# EAGLE design video_kb (EAGLE 7.1.0)
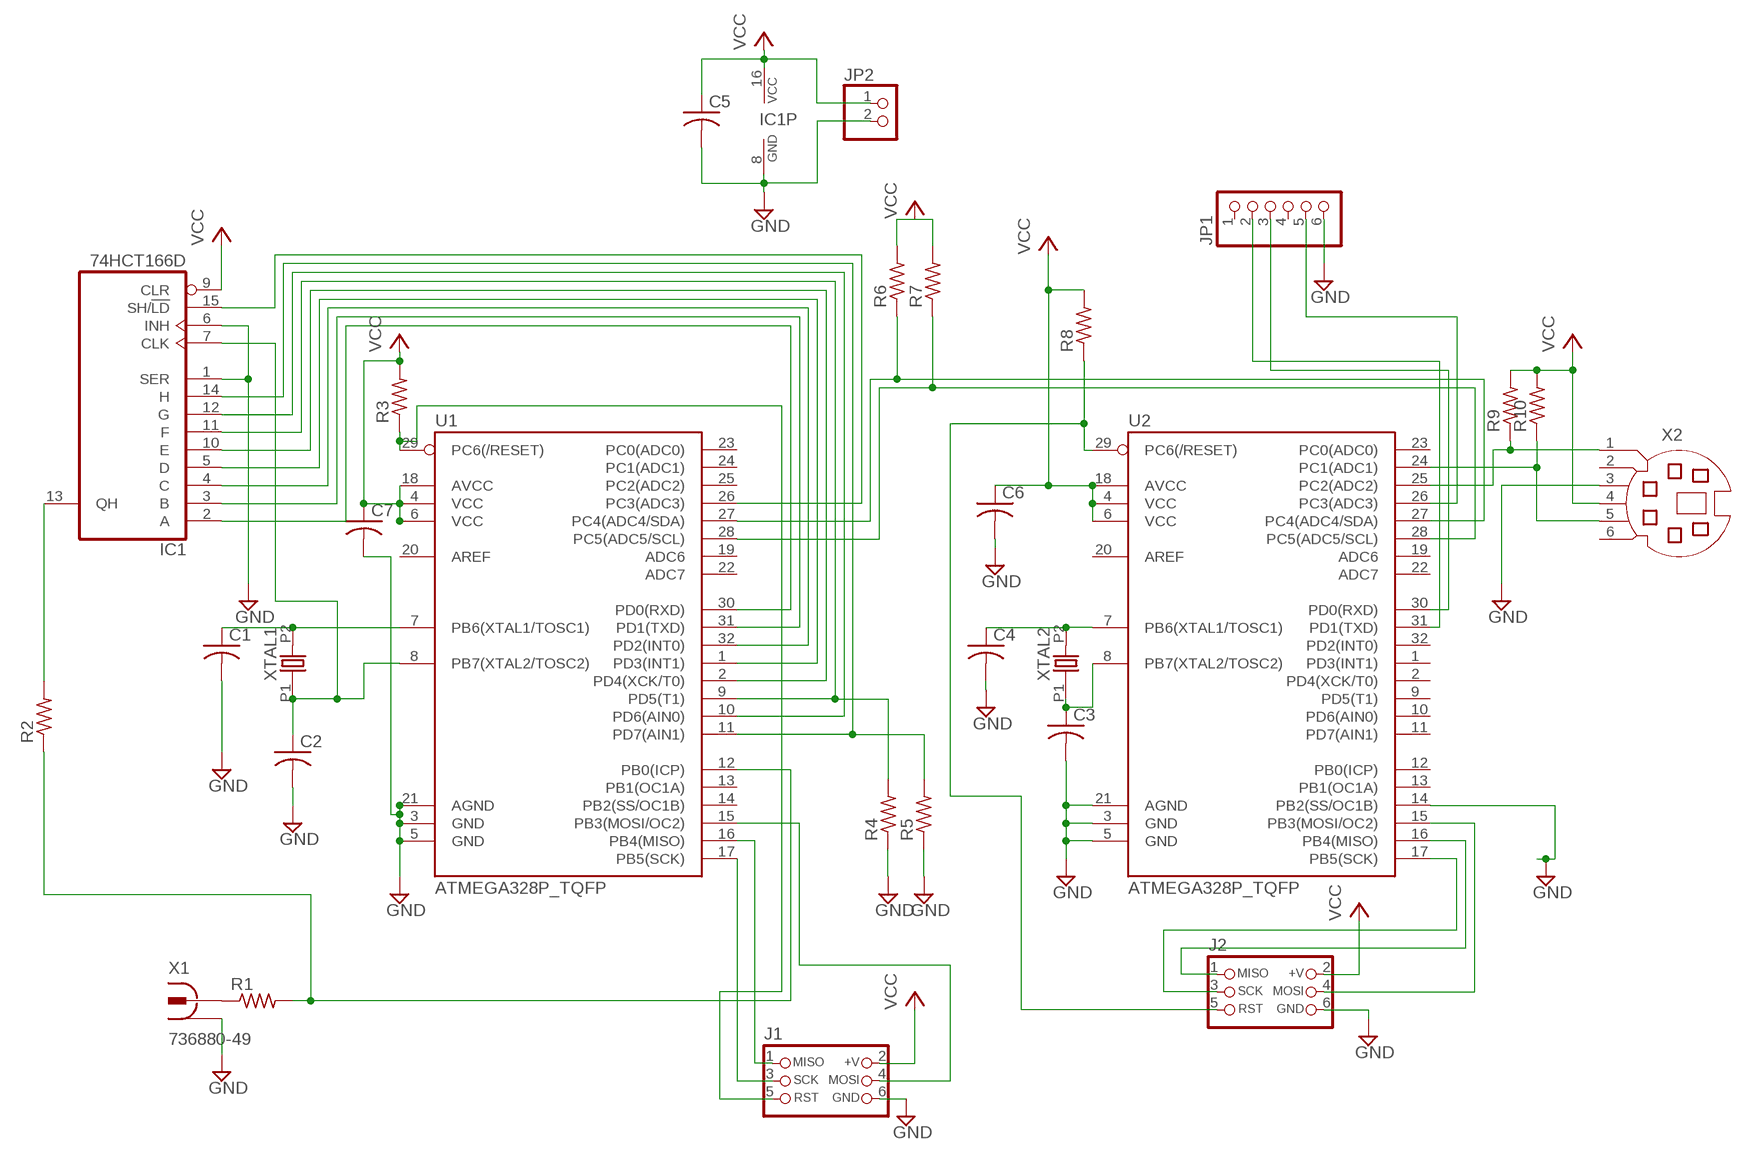
[diagram p0: schematic, sheet 1]

## Parts
C1  C-USC0603K  [C0603K]
C2  C-USC0603K  [C0603K]
C3  C-USC0603K  [C0603K]
C4  C-USC0603K  [C0603K]
C5  C-USC0603K  [C0603K]
C6  C-USC0603K  [C0603K]
C7  C-USC0603K  [C0603K]
IC1  74HCT166D  [SO16]
J1  CON_HEADER_PRG_AVR_ICSP-PTH  [HEADER_PRG_2X03]
J2  CON_HEADER_PRG_AVR_ICSP-PTH  [HEADER_PRG_2X03]
JP1  HEADER-1X6  [1X06_OVAL]
JP2  HEADER-1X2  [1X02_OVAL]
R1  R-US_R0603  [R0603]
R2  R-US_R0603  [R0603]
R3  R-US_R0603  [R0603]
R4  R-US_R0603  [R0603]
R5  R-US_R0603  [R0603]
R6  R-US_R0603  [R0603]
R7  R-US_R0603  [R0603]
R8  R-US_R0603  [R0603]
R9  R-US_R0603  [R0603]
R10  R-US_R0603  [R0603]
U1  ATMEGA328P_TQFP  [TQFP32-08]
U2  ATMEGA328P_TQFP  [TQFP32-08]
X1  736880-49  [736880-49]
X2  MD06S  [MDIN06S]
XTAL1  OSC-XTAL-HC-49U-PTH  [HC-49U-PTH]
XTAL2  OSC-XTAL-HC-49U-PTH  [HC-49U-PTH]

## Nets
GND: C1.2 C2.2 C3.2 C4.2 C5.2 C6.2 C7.2 IC1.1(SER) IC1.6(INH) IC1.8(GND) J1.6(GND) J2.6(GND) JP1.6 JP2.2 R4.1 R5.1 U1.3(GND) U1.5(GND) U1.21(AGND) U2.3(GND) U2.5(GND) U2.14(PB2(SS/OC1B)) U2.21(AGND) X1.1 X1.1@1 X1.1@2 X2.3
N$1: C2.1 IC1.7(CLK) U1.8(PB7(XTAL2/TOSC2)) XTAL1.P1
N$2: C1.1 U1.7(PB6(XTAL1/TOSC1)) XTAL1.P2
N$3: IC1.4(C) U1.32(PD2(INT0))
N$4: IC1.5(D) U1.1(PD3(INT1))
N$5: R1.2 R2.1 U1.12(PB0(ICP))
N$6: R1.1 X1.2
N$7: IC1.13(QH) R2.2
N$8: IC1.10(E) U1.2(PD4(XCK/T0))
N$9: IC1.2(A) U1.30(PD0(RXD))
N$10: IC1.3(B) U1.31(PD1(TXD))
N$11: IC1.11(F) R4.2 U1.9(PD5(T1))
N$12: IC1.12(G) U1.10(PD6(AIN0))
N$13: IC1.14(H) R5.2 U1.11(PD7(AIN1))
N$14: J1.5(RST) R3.1 U1.29(PC6(/RESET))
N$15: IC1.15(SH/!LD) U1.26(PC3(ADC3))
N$16: R6.1 U1.27(PC4(ADC4/SDA)) U2.27(PC4(ADC4/SDA))
N$18: R7.1 U1.28(PC5(ADC5/SCL)) U2.28(PC5(ADC5/SCL))
N$19: J1.4(MOSI) U1.15(PB3(MOSI/OC2))
N$20: C4.1 U2.7(PB6(XTAL1/TOSC1)) XTAL2.P2
N$21: C3.1 U2.8(PB7(XTAL2/TOSC2)) XTAL2.P1
N$22: J2.5(RST) R8.1 U2.29(PC6(/RESET))
N$24: J2.4(MOSI) U2.15(PB3(MOSI/OC2))
N$26: R9.1 U2.25(PC2(ADC2)) X2.1
N$27: J2.1(MISO) U2.16(PB4(MISO))
N$28: J2.3(SCK) U2.17(PB5(SCK))
N$29: R10.1 U2.24(PC1(ADC1)) X2.5
N$34: JP1.5 U2.26(PC3(ADC3))
N$35: JP1.3 U2.30(PD0(RXD))
N$36: JP1.2 U2.31(PD1(TXD))
N$37: J1.1(MISO) U1.16(PB4(MISO))
N$38: J1.3(SCK) U1.17(PB5(SCK))
VCC: C5.1 C6.1 C7.1 IC1.9(CLR) IC1.16(VCC) J1.2(+V) J2.2(+V) JP2.1 R3.2 R6.2 R7.2 R8.2 R9.2 R10.2 U1.4(VCC) U1.6(VCC) U1.18(AVCC) U2.4(VCC) U2.6(VCC) U2.18(AVCC) X2.4
Unconnected: JP1.1 JP1.4 U1.13(PB1(OC1A)) U1.14(PB2(SS/OC1B)) U1.19(ADC6) U1.20(AREF) U1.22(ADC7) U1.23(PC0(ADC0)) U1.24(PC1(ADC1)) U1.25(PC2(ADC2)) U2.1(PD3(INT1)) U2.2(PD4(XCK/T0)) U2.9(PD5(T1)) U2.10(PD6(AIN0)) U2.11(PD7(AIN1)) U2.12(PB0(ICP)) U2.13(PB1(OC1A)) U2.19(ADC6) U2.20(AREF) U2.22(ADC7) U2.23(PC0(ADC0)) U2.32(PD2(INT0)) X2.2 X2.6

## Library data of the parts
C1-C7 = rcl:C-US: CAPACITOR, American symbol
IC1 = 74xx-eu:74*166: 8-bit parallel load SHIFT REGISTER
J1 J2 = dp_devices:CON_HEADER_PRG_AVR_ICSP: 2x3 AVR ICSP programming header
JP1 = microbuilder:HEADER-1X6: PIN HEADER
JP2 = microbuilder:HEADER-1X2: PIN HEADER
R1-R10 = resistor:R-US_: RESISTOR, American symbol
U1 U2 = SparkFun-DigitalIC:ATMEGA328P_TQFP; PROD_ID: IC-09069
X1 = con-conrad:736880-49: Cinch Connector ( RCA Jack ) Cinch-Einbaukupplung 90º 72345 Vernickelt BKL Electronic Source: Conrad <http://www.conrad.de/ce/de/product/736880>
X2 = con-yamaichi:MD06S: YAMAICHI CONNECTOR; OC_FARNELL: unknown; OC_NEWARK: unknown
XTAL1 XTAL2 = dp_devices:OSC-XTAL

## Board
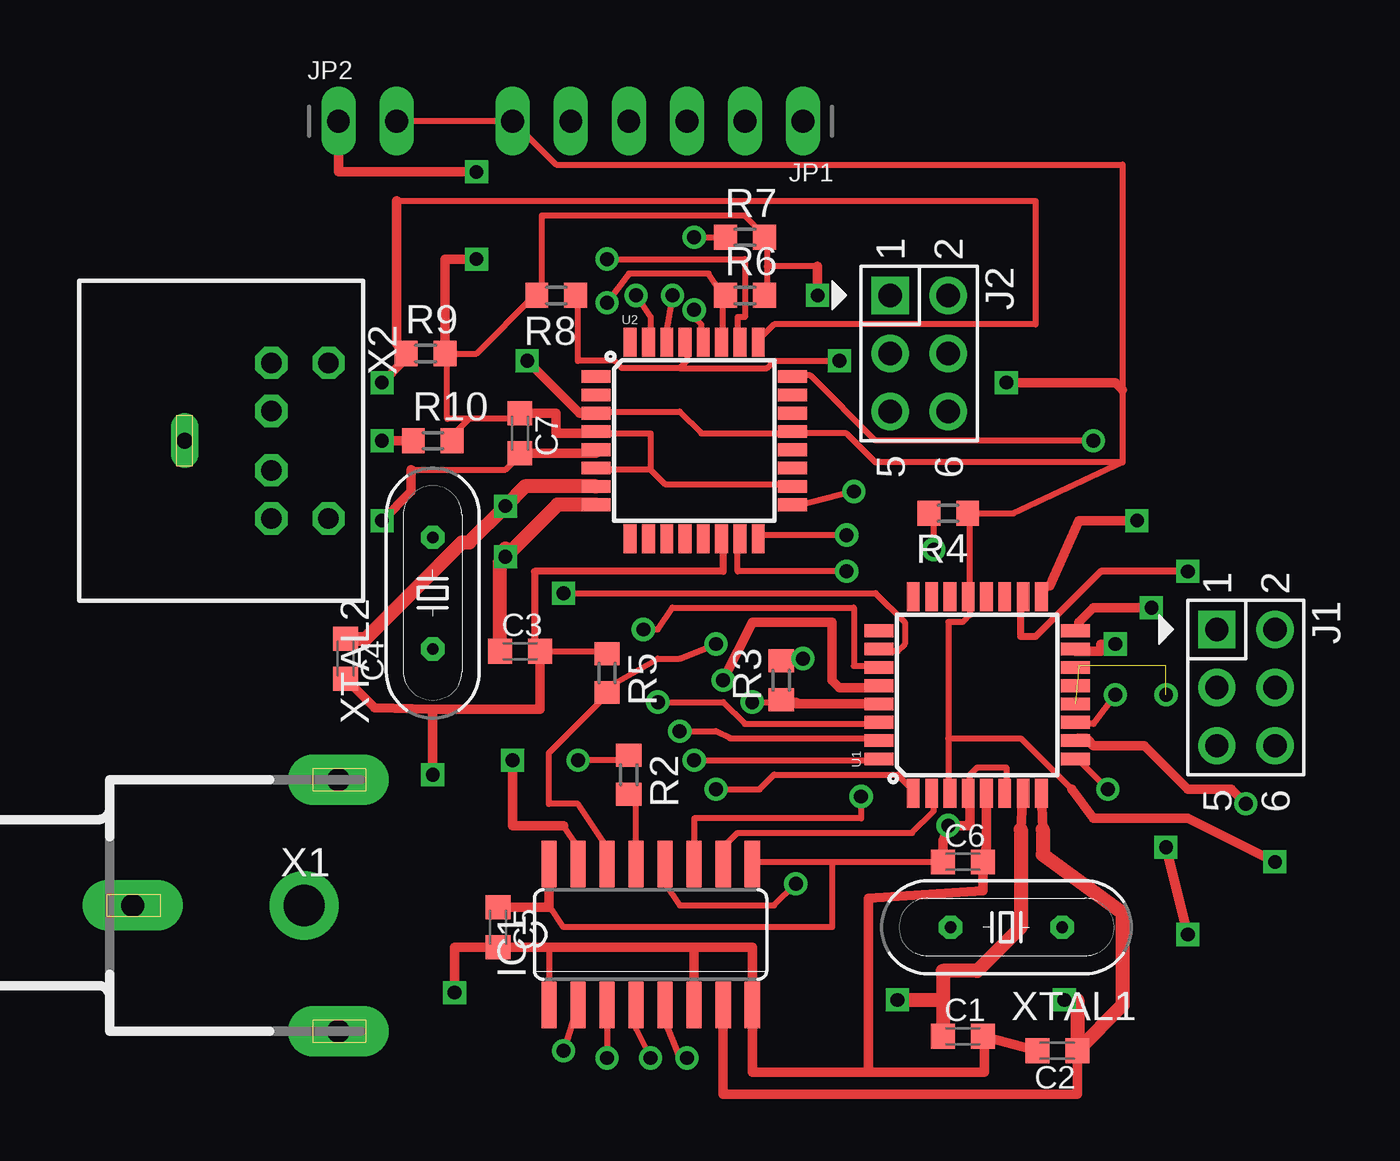
[diagram p1: board, top side]
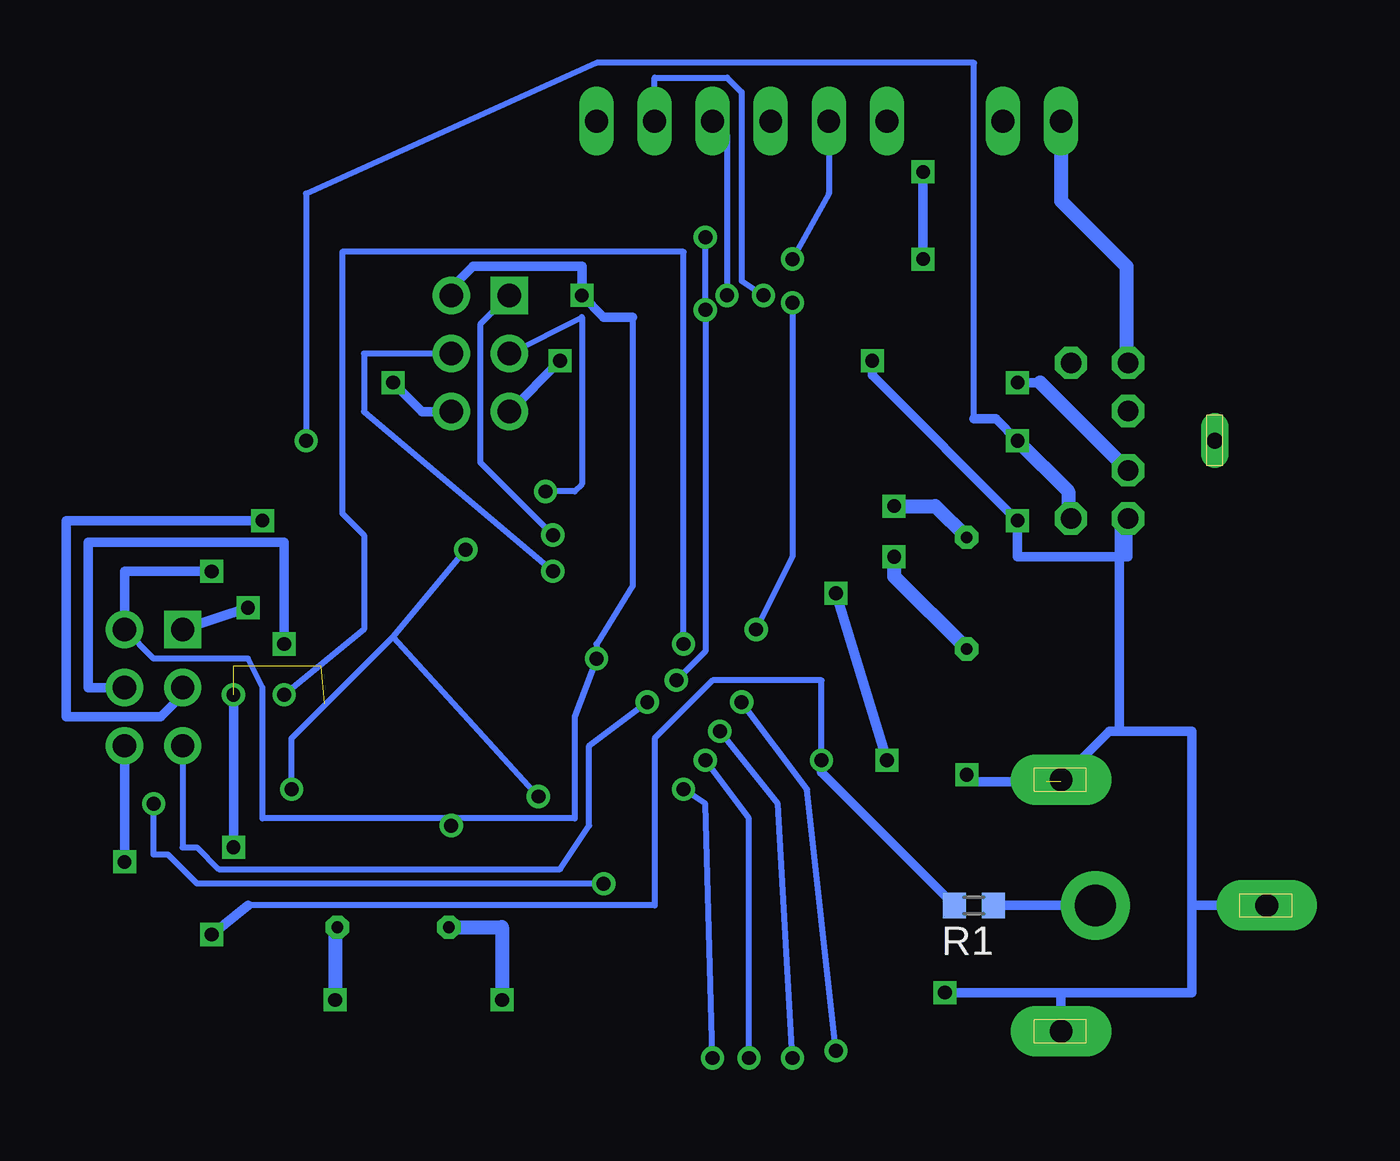
[diagram p2: board, bottom side, seen from below]

No outline drawn. Coordinates in mm, seen from the top.
Copper layers (1*16): Top 0.035mm / dielectric 1.5mm / Bottom 0.035mm
Design rules "default": minimum track width 10mil, minimum drill 24mil, track to track 8mil, track to pad 8mil, pad to pad 8mil, via to via 8mil, smd to smd 8mil, copper to edge 40mil, drill to drill 8mil, minimum pad ring 10mil, minimum via ring 8mil, stop-mask expansion 4mil, vias tented up to drill 0mil, thermal gap 10mil
vRestrict: area 37.5,31.1 to 44.8,37.8; area 49.8,19.4 to 57.2,27; area 33.7,10.8 to 44.1,14.6

### Footprints (pad centres in the part's own frame; a part is rotated, then mirrored left to right if it is on the bottom)
C0603K = smd 1.05 x 1.08: 1 -0.875,0; 2 0.875,0
SO16 = smd 0.66 x 2.032: 1 -4.445,-3.073; 2 -3.175,-3.073; 3 -1.905,-3.073; 4 -0.635,-3.073; 5 0.635,-3.073; 6 1.905,-3.073; 7 3.175,-3.073; 8 4.445,-3.073; 9 4.445,3.073; 10 3.175,3.073; 11 1.905,3.073; 12 0.635,3.073; 13 -0.635,3.073; 14 -1.905,3.073; 15 -3.175,3.073; 16 -4.445,3.073
HEADER_PRG_2X03 = drill 1.02 pad 1.632 square: 1 -2.54,-1.27 | drill 1.02 pad 1.632: 2 -2.54,1.27; 3 0,-1.27; 4 0,1.27; 5 2.54,-1.27; 6 2.54,1.27
1X06_OVAL = drill 1 long: 1 -6.35,0; 2 -3.81,0; 3 -1.27,0; 4 1.27,0; 5 3.81,0; 6 6.35,0
1X02_OVAL = drill 1 long: 1 -1.27,0; 2 1.27,0
R0603 = smd 1 x 1.1: 1 -0.85,0; 2 0.85,0
TQFP32-08 = smd 1.27 x 0.559: 1 -4.293,2.8; 2 -4.293,2; 3 -4.293,1.2; 4 -4.293,0.4; 5 -4.293,-0.4; 6 -4.293,-1.2; 7 -4.293,-2; 8 -4.293,-2.8; 17 4.293,-2.8; 18 4.293,-2; 19 4.293,-1.2; 20 4.293,-0.4; 21 4.293,0.4; 22 4.293,1.2; 23 4.293,2; 24 4.293,2.8 | smd 0.559 x 1.27: 9 -2.8,-4.293; 10 -2,-4.293; 11 -1.2,-4.293; 12 -0.4,-4.293; 13 0.4,-4.293; 14 1.2,-4.293; 15 2,-4.293; 16 2.8,-4.293; 25 2.8,4.293; 26 2,4.293; 27 1.2,4.293; 28 0.4,4.293; 29 -0.4,4.293; 30 -1.2,4.293; 31 -2,4.293; 32 -2.8,4.293
736880-49 = drill 1 pad 2.2 long: 1 -3.92,0; 1@1 5.08,-5.5; 1@2 5.08,5.5 | drill 1.8 pad 3: 2 3.58,0
MDIN06S = drill 0.9 octagon: 1 1.3,8.5; 2 -1.3,8.5; 3 3.4,8.5; 4 -3.4,8.5; 5 3.4,11; 6 -3.4,11 | drill 0.7 long: M 0,4.7
HC-49U-PTH = drill 0.508 octagon: P1 -2.44,0; P2 2.44,0

### Placement (x,y rotation side)
C1  52.7,8.26 0 top
C2  56.83,7.62 180 top
C3  33.34,25.08 0 top
C4  25.72,24.77 270 top
C5  32.38,13.02 270 top
C6  52.7,15.88 0 top
C7  33.34,34.61 270 top
IC1  39.05,12.7 0 top
J1  65.09,23.5 270 top
J2  50.8,38.1 270 top
JP1  39.37,48.26 180 top
JP2  26.67,48.26 0 top
R1  29.21,13.97 180 bottom
R2  38.1,19.68 270 top
R3  44.77,23.81 90 top
R4  52.07,31.11 180 top
R5  37.15,24.13 270 top
R6  43.18,40.64 0 top
R7  43.18,43.18 0 top
R8  34.92,40.64 180 top
R9  29.21,38.1 0 top
R10  29.53,34.29 0 top
U1  53.34,23.18 90 top
U2  40.96,34.29 0 top
X1  20.32,13.97 0 top
X2  13.97,34.29 270 top
XTAL1  54.61,13.02 180 top
XTAL2  29.53,27.62 90 top

### Tracks (layer width: path | path; a pad name or v marks a point on that pad's centre or on a via)
GND  (via drill 0.6)  (1 unrouted)
  Top 0.254: U2.3 36.83,35.56 40.32,35.56 41.27,34.61 45.09,34.61 U2.21 45.4,34.61 47.62,34.61 48.9,33.34 59.69,33.34 | 53.02,31.11 53.02,27.62 U1.21 53.02,27.3 53.02,26.67 52.7,26.35 52.07,26.35 52.07,21.27 | 52.07,21.27 52.07,19.05 U1.3 | 59.69,33.34 54.93,31.11 53.02,31.11 | 53.02,31.11 R4.1 | 57.47,19.05 55.24,21.27 52.07,21.27 | 34.61,12.14 IC1.1 | C3.2 37.15,25.08 R5.1 | 25.4,19.68 X1.1@2 | JP2.2 JP1.6 34.92,46.35 59.69,46.35 59.69,36.51 59.69,33.34 | 28.57,33.02 32.7,33.02 33.34,33.66 C7.2
  Top 0.305: U2.14 42.23,30 42.23,28.57 33.97,28.57 33.97,25.4 34.21,25.4 C3.2
  Top 0.406: C2.2 C1.2 53.66,8.57 53.66,6.67 48.58,6.67 | C4.2 26.99,22.62 29.53,22.54 | 29.53,22.54 34.21,22.54 C3.2 | 40.96,12.14 34.61,12.14 C5.2 30.48,12.14 v30.48,10.16 | 40.96,12.14 43.5,12.14 IC1.8 43.5,6.67 48.58,6.67 | IC1.6 40.96,12.14 | U1.5 53.74,16.51 C6.2 53.58,14.61 48.58,14.29 48.58,6.67 | C7.2 36.66,33.73 U2.5 | 28.57,33.02 28.57,32.07 v27.3,30.8 | 26.04,19.37 26.04,19.68 | v54.61,36.83 59.37,36.83 59.69,36.51 | v66.36,15.88 62.55,17.78 58.42,17.78 57.47,19.05 | 29.53,22.54 v29.53,19.68 | U2.3 35.95,35.49 v33.66,37.78
  Bottom 0.406: 22.86,21.59 22.86,30.89 X2.3 22.47,29.21 27.3,29.21 v27.3,30.8 33.66,37.15 v33.66,37.78 | X1.1@1 25.4,10.16 v30.48,10.16 19.68,10.16 19.68,13.97 | X1.1 19.68,13.97 | 19.68,13.97 19.68,21.59 22.86,21.59 | J2.6 53.34,35.56 v54.61,36.83 | J1.6 v66.36,15.88 | 22.86,21.59 23.28,21.59 X1.1@2 25.4,19.37 29.21,19.37 v29.53,19.68
N$1  (via drill 0.6)
  Top 0.406: U1.8 56.2,17.3 | IC1.7 42.23,5.71 57.71,5.71 C2.1
  Top 0.61: 56.2,17.3 56.2,16.19 59.69,13.65 59.69,9.6 C2.1 57.71,9.84 v57.15,9.84
  Bottom 0.61: XTAL1.P1 57.15,13.02 v57.15,9.84
N$2  (via drill 0.6)
  Top 0.406: U1.7 55.24,17.3
  Top 0.61: 55.24,17.3 55.24,13.02 53.34,11.11 51.83,11.11 51.83,9.84 | 51.83,9.84 C1.1 | v49.85,9.84 51.83,9.84
  Bottom 0.61: XTAL1.P2 49.85,13.02 v49.85,9.84
N$3  (via drill 0.61)
  Top 0.254: v40.96,20.32 48.9,20.32 U1.32 | v39.05,7.3 38.42,8.57 38.42,9.53
  Top 0.406: IC1.4 38.42,9.53
  Bottom 0.254: v40.96,20.32 39.05,17.78 v39.05,7.3
N$4  (via drill 0.61)
  Top 0.254: v41.91,19.05 43.81,19.05 44.45,19.68 49.85,19.68 50.48,19.05 U1.1 | v40.64,7.3 40.32,7.3 39.69,8.89 IC1.5
  Bottom 0.254: v41.91,19.05 40.96,18.41 v40.64,7.3
N$5  (via drill 0.6, 0.61)  (3 unrouted)
  Top 0.254: v35.88,20.32 38.1,20.32 R2.1
  Top 0.406: v61.59,16.51 v62.55,12.7
  Bottom 0.254: 60.96,13.97 43.18,13.97 43.18,21.27 40.64,23.81 35.88,23.81 v35.88,20.32
  Bottom 0.406: v35.88,20.32 35.88,19.79 R1.2 | 61.28,23.18 v61.59,23.18 v61.59,16.51 | v62.55,12.7 60.96,13.97
N$6
  Bottom 0.406: X1.2 R1.1
N$7
  Top 0.254: IC1.13 38.42,18.41 R2.2
N$8
  Top 0.254: IC1.10 42.23,16.51 42.86,17.14 50.48,17.14 51.44,18.1 51.44,18.73 U1.2
N$9  (via drill 0.61)
  Top 0.254: v39.37,22.86 42.23,22.86 43.18,21.91 48.9,21.91 U1.30 | IC1.2 v35.24,7.62
  Bottom 0.254: v39.37,22.86 36.51,19.05 v35.24,7.62
N$10  (via drill 0.61)
  Top 0.254: v40.32,21.59 41.91,21.59 42.55,21.27 48.9,21.27 U1.31 | IC1.3 v37.15,7.3
  Bottom 0.254: v40.32,21.59 37.78,18.41 v37.15,7.3
N$11  (via drill 0.61)
  Top 0.254: v51.44,29.53 51.44,31.11 R4.2 | v59.05,19.05 57.78,20.32 U1.9 | IC1.11 40.96,17.78 48.26,17.78 v48.26,18.73
  Bottom 0.254: 54.61,25.72 59.05,21.27 v59.05,19.05 | 54.61,25.72 v51.44,29.53 | 54.61,25.72 v48.26,18.73
N$12  (via drill 0.61)
  Top 0.254: v45.4,14.92 44.45,13.97 40.32,13.97 39.69,14.92 IC1.12 | 57.78,21.27 U1.10
  Top 0.406: v65.09,18.41 64.45,19.05 62.55,19.05 60.64,20.95 58.42,20.95 58.1,21.27 57.73,21.27 U1.10
  Bottom 0.254: v65.09,18.41 65.09,16.19 64.45,16.19 63.18,14.92 v45.4,14.92
N$13  (via drill 0.61)
  Top 0.254: IC1.14 37.15,16.51 35.88,18.41 34.61,18.41 34.61,20.64 37.15,23.18 R5.2 37.15,23.5 39.37,24.77 40.32,24.77 v41.91,25.4 | v59.37,23.18 58.42,21.91 57.78,21.91 U1.11
  Bottom 0.254: v59.37,23.18 55.88,26.04 55.88,30.16 56.83,31.11 56.83,42.55 41.91,42.55 v41.91,25.4
N$14  (via drill 0.61)
  Top 0.254: v43.5,22.86 45.4,22.86
  Top 0.406: U1.29 45.4,22.78 45.4,22.86 R3.1
  Bottom 0.254: v43.5,22.86 46.04,20.95 46.04,17.46 47.31,15.56 62.23,15.56 63.18,16.51 63.82,16.51 J1.5
N$15  (via drill 0.6)
  Top 0.254: v35.24,27.62 48.9,27.62 50.16,26.35 50.16,25.4 49.85,25.08 49.21,25.08 U1.26 | 35.24,17.46 35.88,16.51 IC1.15
  Top 0.406: 35.24,17.46 33.02,17.46 v33.02,20.32
  Bottom 0.406: v33.02,20.32 v35.24,27.62
N$16  (via drill 0.61)
  Top 0.254: 42.23,40.64 42.23,38.73 U2.27 | v38.73,26.04 39.37,26.04 40.01,26.99 47.94,26.99 47.94,24.45 48.9,24.45 U1.27 | v37.15,40.32 38.1,41.59 41.59,41.59 42.23,40.64 | 42.23,40.64 R6.1
  Bottom 0.254: v38.73,26.04 37.15,29.21 v37.15,40.32
N$18  (via drill 0.61)
  Top 0.254: v40.96,43.18 R7.1 | v40.96,40.01 40.96,39.69 41.27,39.37 41.27,38.73 U2.28 | 48.9,23.5 U1.28
  Top 0.406: 48.9,23.5 47.31,23.5 46.99,23.81 46.99,26.35 43.5,26.35 v42.23,23.81
  Bottom 0.254: v40.96,43.18 v40.96,40.01 40.96,25.08 v42.23,23.81
N$19  (via drill 0.6)
  Top 0.254: 57.78,25.08 U1.15
  Top 0.406: v59.37,25.4 58.74,25.4 58.74,25.08 57.63,25.08 U1.15
  Bottom 0.406: J1.4 67.94,23.5 67.94,29.84 59.37,29.84 v59.37,25.4
N$20  (via drill 0.6)
  Top 0.61: U2.7 33.56,32.29 v32.7,31.43 31.11,29.84 30.8,29.84 26.59,25.64 C4.1
  Bottom 0.61: v32.7,31.43 30.9,31.43 XTAL2.P2
N$21  (via drill 0.6)
  Top 0.406: 32.46,25.18 C3.1
  Top 0.61: 32.7,29.59 v32.7,29.21 | C3.1 32.46,28.97 v32.7,29.21 | U2.8 34.98,31.49 v32.7,29.21
  Bottom 0.61: v32.7,29.21 32.7,28.36 XTAL2.P1
N$22  (via drill 0.6)
  Top 0.254: 40.32,37.47 37.78,37.47 37.47,37.78 35.88,37.78 35.88,40.64 R8.1 | 40.32,37.47 40.64,37.78 40.64,38.42 U2.29 | v47.31,37.78 44.45,37.78 44.13,37.47 40.32,37.47
  Bottom 0.406: v47.31,37.78 J2.5
N$24  (via drill 0.61)
  Top 0.254: v47.62,28.57 42.86,28.57 42.86,29.84 U2.15
  Bottom 0.254: v47.62,28.57 55.88,35.56 55.88,38.1 J2.4
N$26  (via drill 0.6)
  Top 0.254: 28.26,38.1 R9.1 | 27.94,44.77 55.88,44.77 55.88,39.37 44.45,39.37 43.81,38.73 U2.25
  Top 0.406: 27.94,44.77 27.94,38.52 R9.1 | 28.26,38.1 28.26,37.78 v27.3,36.83
  Bottom 0.406: v27.3,36.83 26.31,36.83
  Bottom 0.61: 26.31,36.83 X2.1
N$27  (via drill 0.61)
  Top 0.254: v47.62,30.16 43.81,30.16 U2.16
  Bottom 0.254: v47.62,30.16 50.8,33.34 50.8,39.37 J2.1
N$28  (via drill 0.61)
  Top 0.254: v47.94,32.07 45.4,31.43 U2.17
  Bottom 0.254: v47.94,32.07 46.67,32.07 46.35,32.38 46.35,39.69 J2.3
N$29  (via drill 0.6, 0.61)
  Top 0.254: v58.42,34.29 48.9,34.29 46.04,37.15 45.4,37.15 U2.24
  Top 0.406: R10.1 v27.3,34.29
  Bottom 0.254: v58.42,34.29 58.42,45.09 45.72,50.8 29.21,50.8 29.21,35.24
  Bottom 0.406: 29.21,35.24 28.26,35.24 v27.3,34.29
  Bottom 0.61: v27.3,34.29 25.08,32.07 25.08,31 X2.5
N$34  (via drill 0.61)
  Top 0.254: v37.15,42.23 43.18,42.23 43.18,39.69 42.86,39.69 42.86,38.73 U2.26
  Bottom 0.254: v37.15,42.23 35.56,45.09 JP1.5
N$35  (via drill 0.61)
  Top 0.254: v40.01,40.64 39.69,38.73 U2.30
  Bottom 0.254: v40.01,40.64 40.01,47.62 JP1.3
N$36  (via drill 0.61)
  Top 0.254: v38.42,40.64 39.05,39.69 39.05,38.73 U2.31
  Bottom 0.254: v38.42,40.64 39.37,41.27 39.37,49.53 40.01,50.16 43.18,50.16 JP1.2
N$37  (via drill 0.6)
  Top 0.254: 57.78,26.04 U1.16
  Top 0.406: 57.78,26.04 57.78,26.35 58.42,26.99 v60.96,26.99
  Bottom 0.406: v60.96,26.99 J1.1
N$38  (via drill 0.6)
  Top 0.254: 56.52,27.94 56.2,27.62 U1.17
  Top 0.406: v60.33,30.8 57.78,30.8 56.52,27.94
  Bottom 0.406: J1.3 63.82,23.18 64.77,22.23 68.9,22.23 68.9,30.8 v60.33,30.8
VCC  (via drill 0.6, 0.61)
  Top 0.254: 31.11,35.24 30.16,34.29 R10.2 | 31.11,35.24 33.34,35.24 C7.1 | 30.16,38.1 30.16,35.24 31.11,35.24 | 30.16,38.1 31.43,38.1 33.97,40.64 R8.2 34.29,40.64 34.29,44.13 43.18,44.13 44.13,43.18 | 30.16,38.1 R9.2 | 39.05,33.02 36.83,33.02 U2.6 | 39.05,33.02 39.05,34.61 36.83,34.61 U2.4 | 39.05,33.02 39.69,32.38 45.09,32.38 U2.18 | U1.6 54.61,19.05 54.61,20 53.34,20 53.02,19.68 53.02,19.05 U1.4 | 46.99,15.88 43.5,15.88 IC1.9 | 46.99,15.88 C6.1 | 34.61,13.97 35.24,13.02 46.99,13.02 46.99,15.88 | 55.24,27.3 U1.18 | 44.13,43.18 44.13,41.91 | 44.13,41.91 44.13,40.64 R6.2 | v45.72,24.77 45.4,24.77 R3.2 | 46.35,41.91 44.13,41.91 | 44.13,43.18 R7.2
  Top 0.305: v62.55,28.57 58.74,28.57 55.88,25.72 55.24,25.72 55.24,27.38 U1.18
  Top 0.406: C5.1 34.61,13.89 34.61,13.97 IC1.16 | U1.4 53.02,18.89 53.02,17.46 v52.07,17.46 51.83,16.83 C6.1 | C7.1 34.92,35.48 34.92,34.61 36.66,34.61 U2.4 | JP2.1 25.4,46.04 v31.43,46.04 | v31.43,42.23 30.06,42.23 R9.2 | v46.35,40.64 46.35,41.91
  Bottom 0.254: 22.54,37.78 X2.4 | 44.13,39.69 44.13,27.94 45.72,25.4 v45.72,24.77 46.67,22.23 46.67,17.78 52.07,17.78 | J1.2 65.09,24.77 60.96,24.77 60.33,23.5 60.33,17.78 52.07,17.78 | 52.07,17.78 v52.07,17.46
  Bottom 0.406: v31.43,46.04 v31.43,42.23 | 44.13,39.69 45.4,39.69 v46.35,40.64 46.35,41.91 51.12,41.91 52.07,40.96 J2.2 | J1.2 66.36,28.57 v62.55,28.57
  Bottom 0.61: JP2.1 25.4,44.77 22.54,41.91 22.54,37.76 X2.4
  other vias: 25.4,48.26